# Altium schematic sheet decawave-power.SchDoc
size A
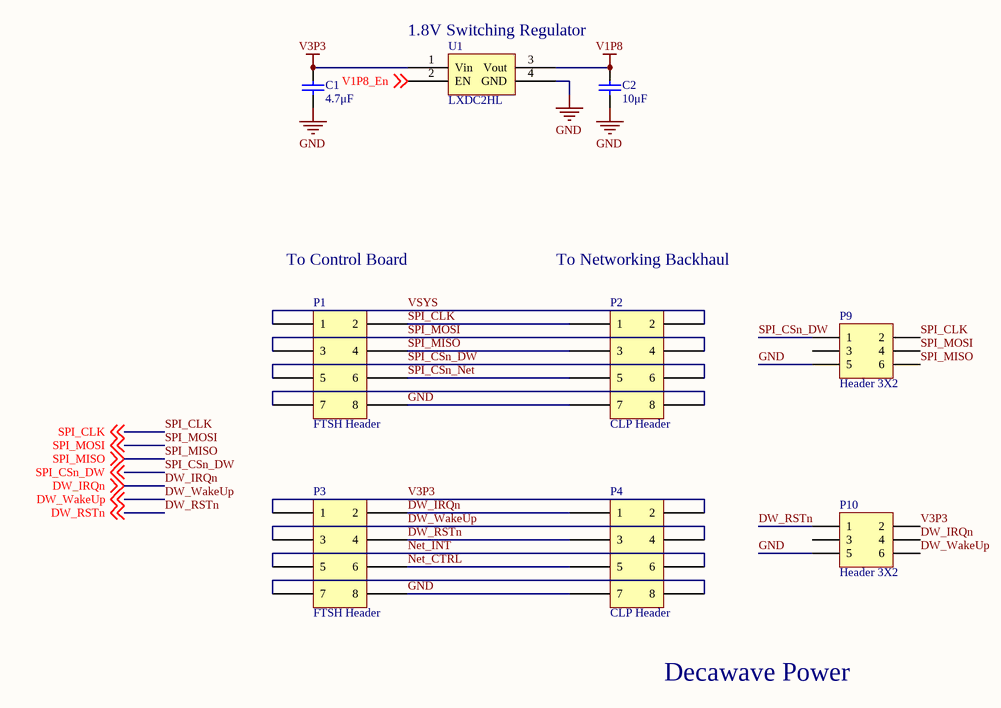
[diagram p0: decawave-power.SchDoc]

## Parts
C1  value 4.7μF  [0603]  (hidden comment: Cap Chip)
C2  value 10μF  [0603]  (hidden comment: Cap Chip)
P1  FTSH Header  [SAM_FTSH_2_4]
P2  CLP Header  [SAM_CLP_2_4]
P3  FTSH Header  [SAM_FTSH_2_4]
P4  CLP Header  [SAM_CLP_2_4]
P9  Header 3X2  [HDR2X3]
P10  Header 3X2  [HDR2X3]
U1  LXDC2HL  [LXDC2HL]

## Nets
GND: C1.2 C2.2 P1.8 P2.7 P3.8 P4.7 P9.5 P10.5 U1.4(GND)
V1P8: C2.1 U1.3(Vout)
V3P3: C1.1 P3.1 P4.2 P10.2 U1.1(Vin)
DW_IRQn: P3.2 P4.1 P10.4 ; off-sheet DW_IRQn
DW_RSTn: P3.4 P4.3 P10.1 ; off-sheet DW_RSTn
DW_WakeUp: P3.3 P4.4 P10.6 ; off-sheet DW_WakeUp
Net_CTRL: P3.6 P4.5
Net_INT: P3.5 P4.6
SPI_CLK: P1.2 P2.1 P9.2 ; off-sheet SPI_CLK
SPI_CSn_DW: P1.5 P2.6 P9.1 ; off-sheet SPI_CSn_DW
SPI_CSn_Net: P1.6 P2.5
SPI_MISO: P1.4 P2.3 P9.6 ; off-sheet SPI_MISO
SPI_MOSI: P1.3 P2.4 P9.4 ; off-sheet SPI_MOSI
V1P8_En: U1.2(EN) ; off-sheet V1P8_En
VSYS: P1.1 P2.2
NetP1_7: P1.7 P2.8
NetP3_7: P3.7 P4.8

Not connected (* = marked no-connect by the designer): P9 3; P10 3

## Notes on the sheet
- 1.8V Switching Regulator
- To Control Board
- To Networking Backhaul
- Decawave Power

## Library data of the parts
C1 = Cap Chip: Capacitor (Semiconductor SIM Model); DistPartNo: 587-1441-1-ND; ManPartNo: LMK107BJ475KA-T; Published: 8-Jun-2000; LatestRevisionDate: 29-May-2009; LatestRevisionNote: IPC-7351 Footprint Added.; PackageReference: C1206; Publisher: Altium Limited; PackageDescription: Chip Capacitor
C2 = Cap Chip: Capacitor (Semiconductor SIM Model); DistPartNo: 587-3412-1-ND; ManPartNo: LMK107BBJ106MAHT; Published: 8-Jun-2000; LatestRevisionDate: 29-May-2009; LatestRevisionNote: IPC-7351 Footprint Added.; PackageReference: C1206; Publisher: Altium Limited; PackageDescription: Chip Capacitor
P1 P3 = FTSH Header: Samtec FTSH 2x4 0.05" Male Header
P2 P4 = CLP Header: Samtec CLP 2x4 0.05" Female Header
P9 P10 = Header 3X2: Header, 3-Pin, Dual row; LatestRevisionDate: 17-Jul-2002; LatestRevisionNote: Re-released for DXP Platform.; Publisher: Altium Limited
U1 = LXDC2HL: DistPartNo: 490-5791-1-ND; ManPartNo: LXDC2HL18A-052